# Altium schematic sheet 3V3_Digital_Out.SchDoc
size B; Author: AM; CompanyName: Expatria Technologies; DrawnBy: A.Marles; Engineer: AM; Organization: Expatria Technolgoies; Address1: PO Box 2084; Address3: Merritt, BC V1K 1B8; Address4: Canada; DocumentNumber: 18; Revision: A2; SheetNumber: 15; SheetTotal: 26
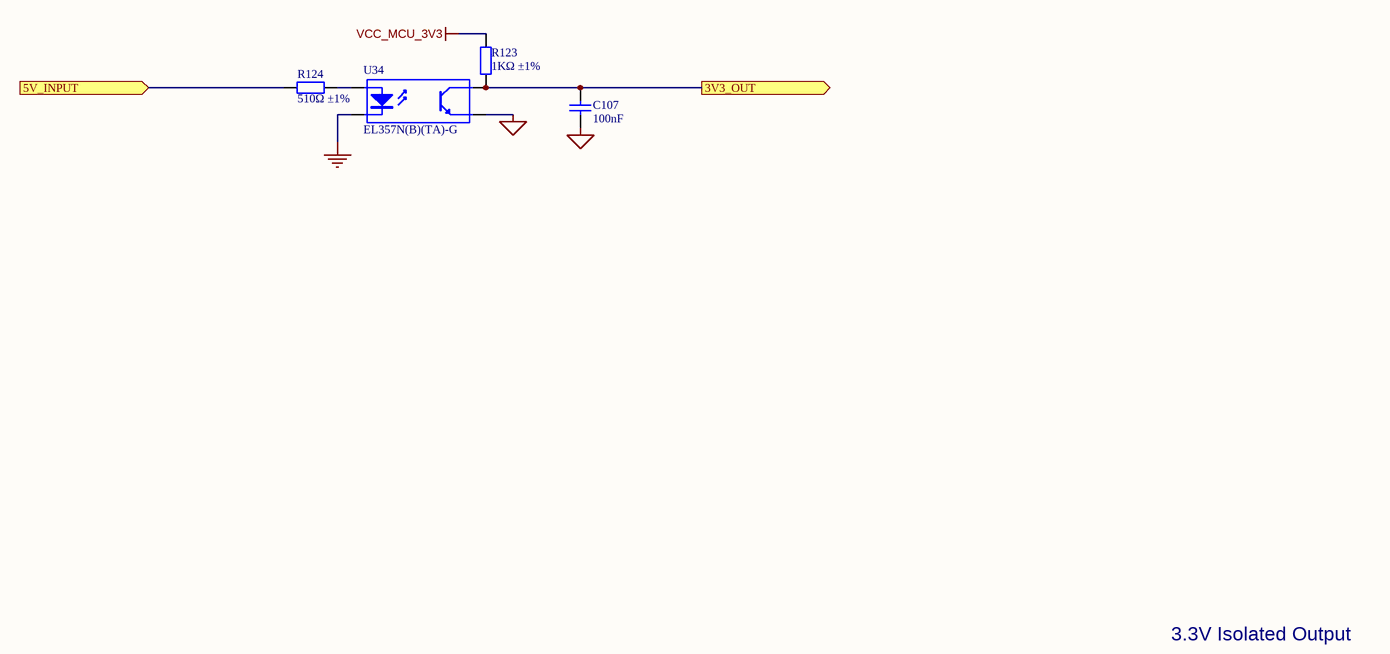
[diagram p0: 3V3_Digital_Out.SchDoc]

## Parts
C107  100nF  [0402_C]
R123  1KΩ ±1%  [0402_R]
R124  510Ω ±1%  [0402_R]
U34  EL357N(B)(TA)-G  [SOP-4_P2.54]

## Ports
3V3_OUT (out), 5V_INPUT (in)

## Nets
GND: U34.2(K)
MCU_GND: C107.1 U34.3(E)
VCC_MCU_3V3: R123.1
3V3_OUT: C107.2 R123.2 U34.4(C) ; port 3V3_OUT
5V_INPUT: R124.1 ; port 5V_INPUT
NetR124_2: R124.2 U34.1(A)

## Notes on the sheet
- 3.3V Isolated Output
- SHEET
- Expatria Technologies
- 625 Kane Valley Rd.
- Box 2084
- Merritt, BC V1K1B8
- PROJECT
- SIZE
- ENGR
- MODIFIED
- DOCUMENT
- REV
- Copyright Sienci Labs 2024. This document describes Open Hardware and is licensed under the CERN-OHL-S v2. No warranty is implied or expressed.
- EMAIL: INFO@EXPATRIA.CA
- B
- /

## Library data of the parts
C107 = 0402 100nF (104) 10% 16V: 16V 100nF X7R ±10% 0402 Multilayer Ceramic Capacitors MLCC - SMD/SMT ROHS; Manufacturer: Samsung Electro-Mechanics; Manufacturer Part Number: CL05B104KO5NNNC; ComponentLink1Description: Supplier link; ComponentLink1URL: http://www.szlcsc.com/product/details_1877.html; Package: 0402; Supplier: LC; SuppliersPartNumber: C1525; Capacitance: 100nF; Tolerance: 10%; Voltage: 16V
R123 = 0402 1K (1001) 1%: Chip resistor; Manufacturer: Uniroyal Elec; Manufacturer Part Number: 0402WGF1001TCE; Power: 1/16W; Package: 0402; Supplier: LC; SuppliersPartNumber: C11702; Resistance: 1KΩ; Tolerance: 1%; ComponentLink1Description: Supplier link; ComponentLink1URL: http://www.szlcsc.com/product/details_12256.html
R124 = 0402 510R (5100) 1%: Chip resistor; Manufacturer: Uniroyal Elec; Manufacturer Part Number: 0402WGF5100TCE; Power: 1/16W; ComponentLink1Description: Supplier link; ComponentLink1URL: http://www.szlcsc.com/product/details_25866.html; Package: 0402; Supplier: LC; SuppliersPartNumber: C25123; Resistance: 510Ω; Tolerance: 1%
U34 = EL357N(B)(TA)-G_[C6649]: 80V 3750V 50mA 0.1V@1mA,20mA 1 6V 1.2V DC SOP-4-2.54mm Optocouplers - Phototransistor Output ROHS; Manufacturer 1: Everlight Elec; ComponentLink1Description: 供应商链接; ComponentLink1URL: http://www.szlcsc.com/product/details_7114.html; Package: SOP-4_P2.54; Supplier: LCSC; SuppliersPartNumber: C6649; Manufacturer Part Number 1: EL357N(B)(TA)-G; Manufacturer: Everlight Elec; Manufacturer Part Number: EL357N(B)(TA)-G